# Altium schematic sheet dtb220-schematic.SchDoc
size A; SheetNumber: 1; SheetTotal: 1
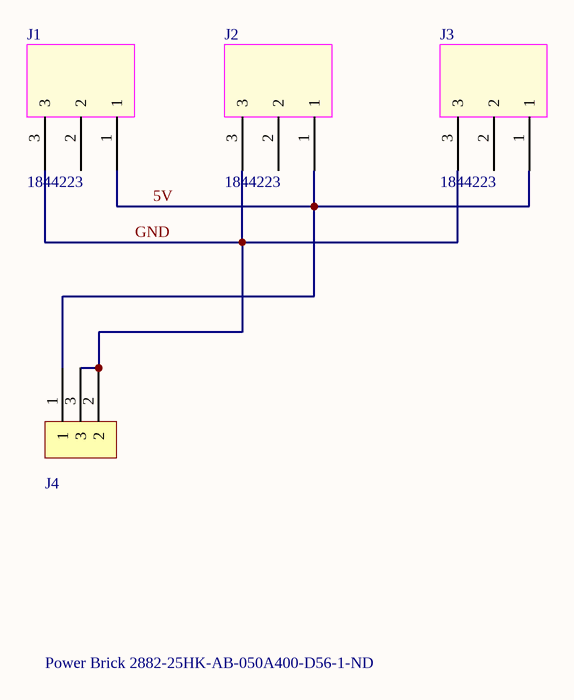
[diagram p0: dtb220-schematic.SchDoc]

## Parts
J1  1844223  [1844223]
J2  1844223  [1844223]
J3  1844223  [1844223]
J4  EJ508A  [EJ508A]  (value not drawn)

## Nets
5V: J1.1 J2.1 J3.1 J4.1
GND: J1.3 J2.3 J3.3 J4.2 J4.3

Not connected (* = marked no-connect by the designer): J1 2; J2 2; J3 2

## Notes on the sheet
- Power Brick 2882-25HK-AB-050A400-D56-1-ND

## Library data of the parts
J1-J3 = 1844223: 3 Position Terminal Block Header, Male Pins, Shrouded (4 Side) 0.138" (3.50mm) 90°, Right Angle Through Hole; Manufacturer: Phoenix Contact; Vendor: Digikey; Vendor PN: 277-2415-ND; VoltServer PN: CON-00009; Manufacturer PN: 1844223
J4 = EJ508A: CONN PWR JACK 2.1X5.5MM SOLDER; Manufacturer: MPD; Vendor: Digikey; Vendor PN: EJ508A-ND; Manufacturer PN: EJ508A